# Altium schematic sheet rlink.schdoc
size 209 x 297 mm
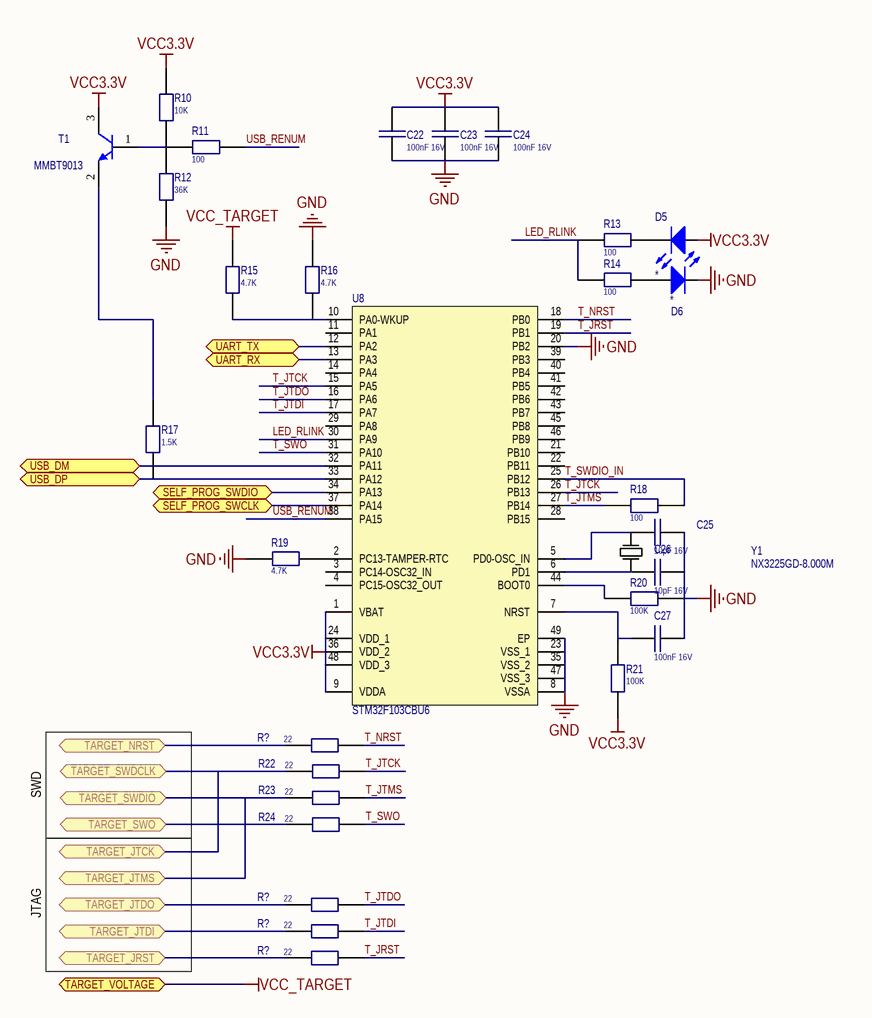
[diagram p0: rlink.schdoc]

## Parts
(Parts that share a designator on the sheet are numbered #1, #2 ... from top to bottom, then left to right.)
C22  100nF 16V  [C_0402]
C23  100nF 16V  [C_0402]
C24  100nF 16V  [C_0402]
C25  10pF 16V  [C_0402]
C26  10pF 16V  [C_0402]
C27  100nF 16V  [C_0402]
D5  *  [LED_1206]
D6  *  [LED_1206]
R10  10K  [R_0402]
R11  100  [R_0402]
R12  36K  [R_0402]
R13  100  [R_0402]
R14  100  [R_0402]
R15  4.7K  [R_0402]
R16  4.7K  [R_0402]
R17  1.5K  [R_0402]
R18  100  [R_0402]
R19  4.7K  [R_0402]
R20  100K  [R_0402]
R21  100K  [R_0402]
R22  22  [R_0402]
R23  22  [R_0402]
R24  22  [R_0402]
R?#1  22  [R_0402]
R?#2  22  [R_0402]
R?#3  22  [R_0402]
R?#4  22  [R_0402]
T1  MMBT9013  [SOT23]
U8  STM32F103CBU6  [STM-UFQFPN48_M]
Y1  NX3225GD-8.000M  [NX3225GD]

## Ports
SELF_PROG_SWCLK, SELF_PROG_SWDIO, TARGET_JRST (bidir), TARGET_JTCK (bidir), TARGET_JTDI (bidir), TARGET_JTDO (bidir), TARGET_JTMS (bidir), TARGET_NRST (bidir), TARGET_SWDCLK (bidir), TARGET_SWDIO (bidir), TARGET_SWO (bidir), TARGET_VOLTAGE (bidir), UART_RX, UART_TX, USB_DM, USB_DP

## Nets
GND: C22.1 C23.1 C24.1 C25.1 C26.1 C27.1 D6.2(K) R12.2 R16.2 R19.2 R20.1 U8.8(VSSA) U8.20(PB2) U8.23(VSS_1) U8.35(VSS_2) U8.47(VSS_3) U8.49(EP)
VCC3.3V: C22.2 C23.2 C24.2 D5.1(A) R10.2 R21.2 T1.3(C) U8.1(VBAT) U8.9(VDDA) U8.24(VDD_1) U8.36(VDD_2) U8.48(VDD_3)
VCC_TARGET: R15.2 ; port TARGET_VOLTAGE
LED_RLINK: R13.2 R14.2 U8.30(PA9)
SELF_PROG_SWCLK: U8.37(PA14) ; port SELF_PROG_SWCLK
SELF_PROG_SWDIO: U8.34(PA13) ; port SELF_PROG_SWDIO
T_JRST: R?#4.1 U8.19(PB1)
T_JTCK: R22.1 U8.15(PA5) U8.26(PB13)
T_JTDI: R?#3.1 U8.17(PA7)
T_JTDO: R?#2.1 U8.16(PA6)
T_JTMS: R18.2 R23.1 U8.27(PB14)
T_NRST: R?#1.1 U8.18(PB0)
T_SWDIO_IN: R18.1 U8.25(PB12)
T_SWO: R24.1 U8.31(PA10)
TARGET_JRST: R?#4.2 ; port TARGET_JRST
TARGET_JTCK: R22.2 ; port TARGET_SWDCLK, port TARGET_JTCK
TARGET_JTDI: R?#3.2 ; port TARGET_JTDI
TARGET_JTDO: R?#2.2 ; port TARGET_JTDO
TARGET_JTMS: R23.2 ; port TARGET_SWDIO, port TARGET_JTMS
TARGET_NRST: R?#1.2 ; port TARGET_NRST
TARGET_SWO: R24.2 ; port TARGET_SWO
UART_RX: U8.13(PA3) ; port UART_RX
UART_TX: U8.12(PA2) ; port UART_TX
USB_DM: U8.32(PA11) ; port USB_DM
USB_DP: R17.1 U8.33(PA12) ; port USB_DP
USB_RENUM: R11.1 U8.38(PA15)
NetC25_2: C25.2 U8.5(PD0-OSC_IN) Y1.2(OSC2)
NetC26_2: C26.2 U8.6(PD1) Y1.1(OSC1)
NetC27_2: C27.2 R21.1 U8.7(NRST)
NetD5_2: D5.2(K) R13.1
NetD6_1: D6.1(A) R14.1
NetR10_1: R10.1 R11.2 R12.1 T1.1(B)
NetR15_1: R15.1 R16.1 U8.10(PA0-WKUP)
NetR17_2: R17.2 T1.2(E)
NetR19_1: R19.1 U8.2(PC13-TAMPER-RTC)
NetR20_2: R20.2 U8.44(BOOT0)

Not connected (* = marked no-connect by the designer): U8 3(PC14-OSC32_IN) 4(PC15-OSC32_OUT) 11(PA1) 14(PA4) 21(PB10) 22(PB11) 28(PB15) 29(PA8) 39(PB3) 40(PB4) 41(PB5) 42(PB6) 43(PB7) 45(PB8) 46(PB9)

## Notes on the sheet
- SWD
- JTAG

## Library data of the parts
C22-C27 = C0402: Capacitor
D5 D6 = LED_SMT_1206: Typical INFRARED GaAs LED; Value: *; Color: *
R10-R24 R?#1-R?#4 = R0402: Resistor
  R10: Value: 10K
  R11 R13 R14 R18: Value: 100
  R12: Value: 36K
  R15 R16 R19: Value: 4.7K
  R17: Value: 1.5K
  R20 R21: Value: 100K
  R22-R24 R?#1-R?#4: Value: 22
T1 = NPN: NPN Bipolar Transistor; Code - JEDEC: TO-226-AA; Published: 8-Jun-2000; Revision: July-2002: Re-released for DXP Platform.; Publisher: Altium Limited
U8 = STM32F103CBU6: STM32 ARM-based 32-bit MCU Performance Line with 128 kB Flash, 20 kB Internal RAM, -40 to +85°C Temperature, 48-Pin VFQFPN, Tray; DatasheetVersion: rev13.0, Apr-2011; PackageVersion: 2011; PackageReference: VFQFPN48; PackageDescription: 48-Pin Quad Flat No-Lead, 7 x 7 x 0.9 mm Body, 0.5 mm Pitch, Exposed Pad; ComponentLink1Description: Manufacturer URL; ComponentLink1URL: http://www.st.com/; ComponentLink2Description: STM32F103 Datasheet; ComponentLink2URL: http://www.st.com/internet/com/TECHNICAL_RESOURCES/TECHNICAL_LITERATURE/DATASHEET/CD00161566.pdf; ComponentLink3Description: STM32 Family Web Page; ComponentLink3URL: www.st.com/stm32
Y1 = NX3225GD: Crystal Oscillator